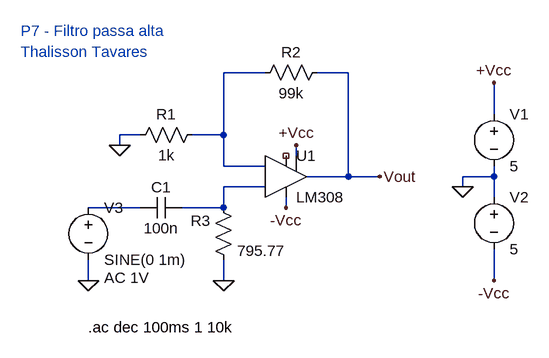
[diagram p0: schematic P7 - High-pass filter.asc]
P7 - High-pass filter.asc, the LTspice schematic file:
Version 4
SHEET 1 1868 904
WIRE 400 112 336 112
WIRE 528 112 480 112
WIRE 752 176 752 128
WIRE 208 208 176 208
WIRE 336 208 336 112
WIRE 336 208 288 208
WIRE 176 224 176 208
WIRE 448 240 448 224
WIRE 336 256 336 208
WIRE 400 256 336 256
WIRE 528 272 528 112
WIRE 528 272 464 272
WIRE 576 272 528 272
WIRE 752 272 752 256
WIRE 752 272 704 272
WIRE 400 288 336 288
WIRE 704 288 704 272
WIRE 752 304 752 272
WIRE 208 320 128 320
WIRE 336 320 336 288
WIRE 336 320 272 320
WIRE 432 320 432 304
WIRE 128 432 128 400
WIRE 336 432 336 400
WIRE 752 432 752 384
FLAG 176 224 0
FLAG 336 432 0
FLAG 704 288 0
FLAG 752 128 +Vcc
FLAG 752 432 -Vcc
FLAG 448 224 +Vcc
FLAG 432 320 -Vcc
FLAG 128 432 0
FLAG 576 272 Vout
SYMBOL OpAmps\\LM308 432 208 R0
SYMATTR InstName U1
SYMBOL res 304 192 R90
WINDOW 0 0 56 VBottom 2
WINDOW 3 32 56 VTop 2
SYMATTR InstName R1
SYMATTR Value 1k
SYMBOL cap 272 304 R90
WINDOW 0 0 32 VBottom 2
WINDOW 3 32 32 VTop 2
SYMATTR InstName C1
SYMATTR Value 100n
SYMBOL res 496 96 R90
WINDOW 0 0 56 VBottom 2
WINDOW 3 32 56 VTop 2
SYMATTR InstName R2
SYMATTR Value 99k
SYMBOL res 352 416 R180
WINDOW 0 36 76 Left 2
WINDOW 3 -79 30 Left 2
SYMATTR InstName R3
SYMATTR Value 795.77
SYMBOL voltage 752 160 R0
WINDOW 123 0 0 Left 0
WINDOW 39 0 0 Left 0
SYMATTR InstName V1
SYMATTR Value 5
SYMBOL voltage 752 288 R0
WINDOW 123 0 0 Left 0
WINDOW 39 0 0 Left 0
SYMATTR InstName V2
SYMATTR Value 5
SYMBOL voltage 128 304 R0
WINDOW 123 24 124 Left 2
WINDOW 39 0 0 Left 0
SYMATTR InstName V3
SYMATTR Value SINE(0 1m)
SYMATTR Value2 AC 1V
TEXT 24 48 Left 2 ;P7 - Filtro passa alta
TEXT 24 80 Left 2 ;Thalisson Tavares
TEXT 128 504 Left 2 !.ac dec 100ms 1 10k

The netlist it stands for:
* P7 - High-pass filter.asc
XU1 N002 N001 +Vcc -Vcc Vout NC_01 NC_02 LT1008
R1 N001 0 1k
C1 N002 N003 100n
R2 Vout N001 99k
R3 0 N002 795.77
V1 +Vcc 0 5
V2 0 -Vcc 5
V3 N003 0 SINE(0 1m) AC 1V
* P7 - Filtro passa alta
* Thalisson Tavares
.ac dec 100ms 1 10k
.lib LTC.lib
.backanno
.end